# Altium project Temperaturkort.PrjPcb
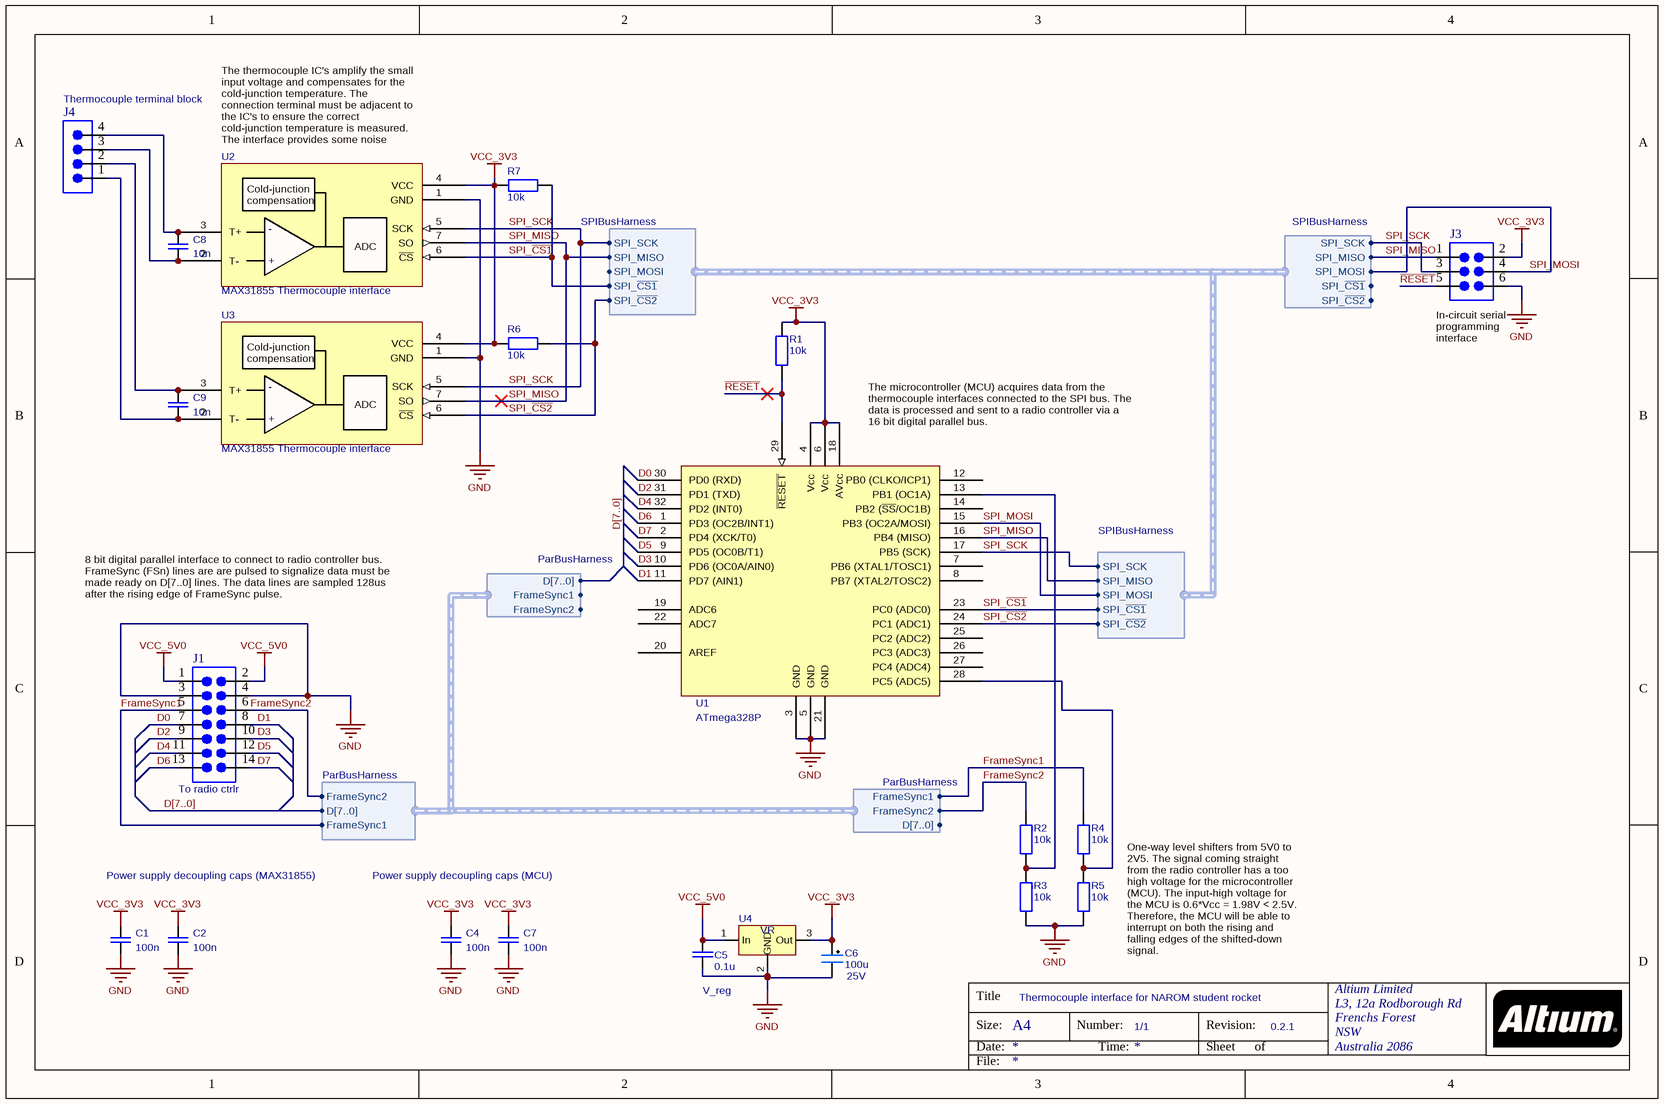
[diagram p0: Sheet1.SchDoc]
1 sheet, 22 parts. Net scope: global (net labels, ports and power ports of the same name join across sheets).
Board files: pcb.PcbDoc, pcb_outline.PcbDoc

## Sheet Sheet1.SchDoc
size A4; Organization: Altium Limited; Address1: L3, 12a Rodborough Rd; Address2: Frenchs Forest; Address3: NSW; Address4: Australia 2086; PageSetup: Record=PageOptions|CenterHorizontal=True|CenterVertical=True|PrintScale=1.00|XCorrection=1.00|YCorrection=1.00|PrintKind=1|BorderSize=5000000|LeftOffset=0|BottomOffset=0|Orientation=2|PaperLength=1000|PaperWidth=1000|Scale=100|PaperSource=7|PrintQuality=600|MediaType=1|DitherType=10|PrintScaleMode=1|PaperKind=A4|PaperIndex=9

### Parts
C1  100n  [cap_0603_standard]
C2  100n  [cap_0603_standard]
C4  100n  [cap_0603_standard]
C5  0.1u  [cap_0603_standard]
C6  100u  Voltage rating: 25V  [cap_tantalum_eia_size_7343-31]
C7  100n  [cap_0603_standard]
C8  10n  [cap_0603_standard]
C9  10n  [cap_0603_standard]
J1  To radio ctrlr  [con_datamate_2row_14pin]
J3  Header 2x3pin  [HEADER_2X3]  (value not drawn)
J4  Thermocouple terminal block  [con_harting_spring_cage_4way]
R1  10k  [res_0603_standard]
R2  10k  [res_0603_standard]
R3  10k  [res_0603_standard]
R4  10k  [res_0603_standard]
R5  10k  [res_0603_standard]
R6  10k  [res_0603_standard]
R7  10k  [res_0603_standard]
U1  ATmega328P  [ic_atmel_atmega328p]
U2  MAX31855 Thermocouple interface  [SO8_N]
U3  MAX31855 Thermocouple interface  [SO8_N]
U4  V_reg  [ic_lin_reg_lm3940_sot223]

### Harnesses
ParBusHarness: FrameSync1, D[7..0], FrameSync2
ParBusHarness: D[7..0], FrameSync1, FrameSync2
ParBusHarness: FrameSync1, FrameSync2, D[7..0]
SPIBusHarness: SPI_SCK, SPI_MISO, SPI_~{CS1}, SPI_MOSI, SPI_~{CS2}

### Nets
GND: C1.1 C2.1 C4.1 C5.1 C6.2 C7.1 J1.3 J1.4 J3.6 R3.2 R5.2 U1.3(GND) U1.5(GND) U1.21(GND) U2.1(GND) U3.1(GND) U4.2(GND)
VCC_3V3: C1.2 C2.2 C4.2 C6.1 C7.2 J3.2 R1.1 R6.1 R7.1 U1.4(Vcc) U1.6(Vcc) U1.18(AVcc) U2.4(VCC) U3.4(VCC) U4.3(Out)
VCC_5V0: C5.2 J1.1 J1.2 U4.1(In)
D0: J1.7 U1.30(PD0_(RXD))
D1: J1.8 U1.11(PD7_(AIN1))
D2: J1.9 U1.31(PD1_(TXD))
D3: J1.10 U1.10(PD6_(OC0A/AIN0))
D4: J1.11 U1.32(PD2_(INT0))
D5: J1.12 U1.9(PD5_(OC0B/T1))
D6: J1.13 U1.1(PD3_(OC2B/INT1))
D7: J1.14 U1.2(PD4_(XCK/T0))
FrameSync1: J1.5 R4.1 ; harness ParBusHarness.FrameSync1
FrameSync2: J1.6 R2.1 ; harness ParBusHarness.FrameSync2
~{RESET}: J3.5 R1.2 U1.29(~{RESET})
SPI_~{CS1}: R7.2 U1.23(PC0_(ADC0)) U2.6(~{CS}) ; harness SPIBusHarness.SPI_~{CS1}
SPI_~{CS2}: R6.2 U1.24(PC1_(ADC1)) U3.6(~{CS}) ; harness SPIBusHarness.SPI_~{CS2}
SPI_MISO: J3.1 U1.16(PB4_(MISO)) U2.7(SO) U3.7(SO) ; harness SPIBusHarness.SPI_MISO
SPI_MOSI: J3.4 U1.15(PB3_(OC2A/MOSI)) ; harness SPIBusHarness.SPI_MOSI
SPI_SCK: J3.3 U1.17(PB5_(SCK)) U2.5(SCK) U3.5(SCK) ; harness SPIBusHarness.SPI_SCK
NetC8_1: C8.1 J4.3 U2.2(T-)
NetC8_2: C8.2 J4.4 U2.3(T+)
NetC9_1: C9.1 J4.1 U3.2(T-)
NetC9_2: C9.2 J4.2 U3.3(T+)
NetR2_2: R2.2 R3.1 U1.13(PB1_(OC1A))
NetR4_2: R4.2 R5.1 U1.28(PC5_(ADC5))

Not connected (* = marked no-connect by the designer): U1 7(PB6_(XTAL1/TOSC1)) 8(PB7_(XTAL2/TOSC2)) 12(PB0_(CLKO/ICP1)) 14(PB2_(~{SS}/OC1B)) 19(ADC6) 20(AREF) 22(ADC7) 25(PC2_(ADC2)) 26(PC3_(ADC3)) 27(PC4_(ADC4))

### Buses and harness runs
bus D[7..0]

### Notes on the sheet
- (near U2) The thermocouple IC's amplify the small input voltage and compensates for the cold-junction temperature. The connection terminal must be adjacent to the IC's to ensure the correct cold-junction temperature is measured. The interface provides some noise reduction.
- (near J3) In-circuit serial programming interface
- (near U1) The microcontroller (MCU) acquires data from the thermocouple interfaces connected to the SPI bus. The data is processed and sent to a radio controller via a 16 bit digital parallel bus.
- 8 bit digital parallel interface to connect to radio controller bus. FrameSync (FSn) lines are are pulsed to signalize data must be made ready on D[7..0] lines. The data lines are sampled 128us after the rising edge of FrameSync pulse.
- Power supply decoupling caps (MAX31855)
- Power supply decoupling caps (MCU)
- One-way level shifters from 5V0 to 2V5. The signal coming straight from the radio controller has a too high voltage for the microcontroller (MCU). The input-high voltage for the MCU is 0.6*Vcc = 1.98V < 2.5V. Therefore, the MCU will be able to interrupt on both the rising and falling edges of the shifted-down signal.
- Thermocouple interface for NAROM student rocket
- 1/1
- 0.2.1
- Title
- Size:
- Date:
- A4
- Number:
- Time:
- Revision:
- Sheet
- of
- File:
- (in symbol ic_lin_vreg_LM78xx) VR
- (in symbol ic_maxim_max31855_thermocouple_interface_simplified) Cold-junction / compensation; -; ADC; +

### Library data of the parts
C1 C2 C4 C5 C7-C9 = cap__genCapUnipol: Generic unipolarised capasitor; Voltage rating: ? V
  C1 C2 C4 C7: Value: 100n
  C5: Value: 0.1u
  C8 C9: Value: 10n
C6 = cap_genCap_polar: Generic polar capacitor; Value: 100u
J1 = con_head_2x07pin: Header 2x7pin
J3 = con_head_2x03pin
J4 = con_head_1x04pin: Header 1x4pin
R1-R7 = res__genResistor: Generic resistor; Watt rating: ? mW; Value: 10k
U1 = ic_atmel_atmega328p: Atmel 8 bit microcontroller; Supply voltage: *; Clock frequency: *
U2 U3 = ic_maxim_max31855_thermocouple_interface_simplified: Maxim MAX31855 thermocouple interface
U4 = ic_lin_vreg_LM78xx: Positive voltage regulator 78xx